# Altium schematic sheet Power.SchDoc
size A4; SheetNumber: 6; SheetTotal: 7
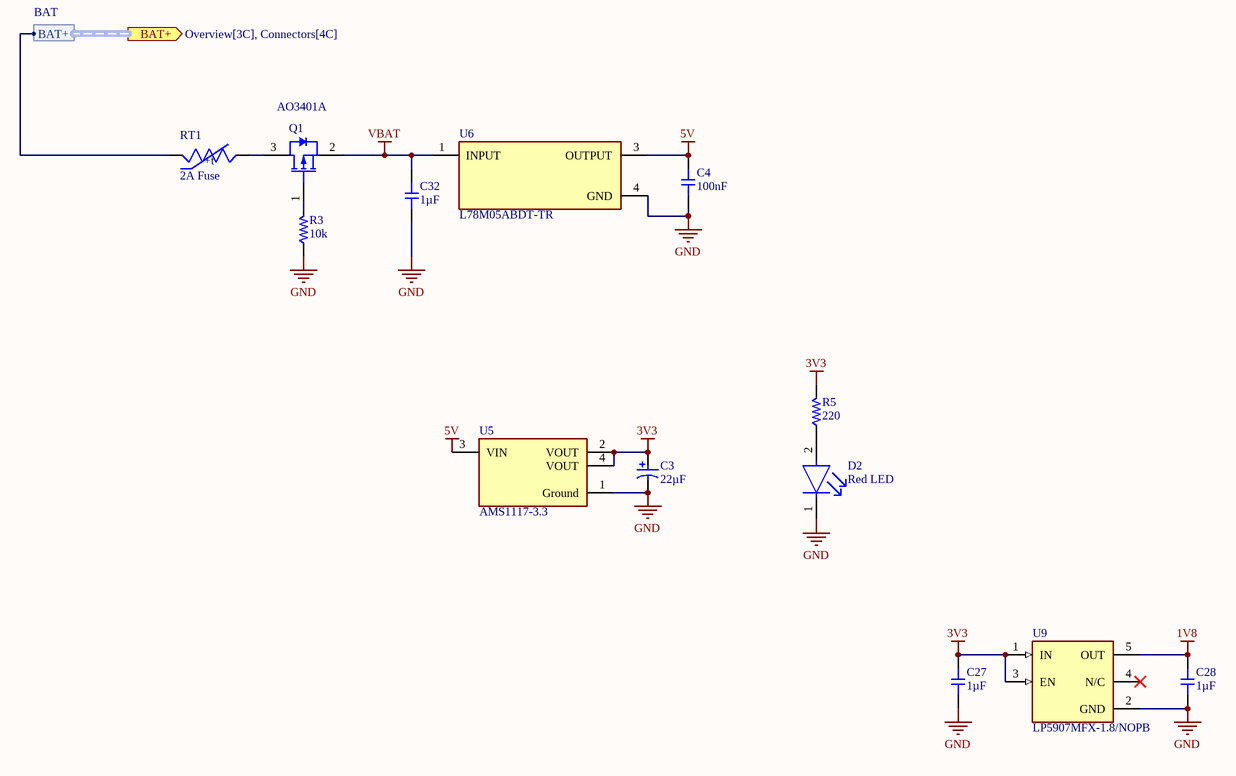
[diagram p0: Power.SchDoc]

## Parts
C3  value 22µF  [KEMT-T491-B_M]  (hidden comment: TR3B226K010C0700)
C4  value 100nF  [CAP-0402]  (hidden comment: CL05B104KO5NNNC)
C27  value 1µF  [CAP-0402]  (hidden comment: CL05A105KA5NQNC)
C28  value 1µF  [CAP-0402]  (hidden comment: CL05A105KA5NQNC)
C32  value 1µF  [CAP-0402]  (hidden comment: CL05A105KA5NQNC)
D2  Red LED  [FP-LTST-C190GKT-MFG]
Q1  AO3401A  [AO-SOT-23-3L_V]
R3  value 10k  [RES-0402]  (hidden comment: 0402WGF1002TCE)
R5  value 220  [RES-0402]  (hidden comment: 0402WGF2200TCE)
RT1  2A Fuse  [THRMC1608X95N]
U5  AMS1117-3.3  [FP-AMS1117-IPC_B]
U6  L78M05ABDT-TR  [FP-L78M05ABDT-TR-MFG]
U9  LP5907MFX-1.8/NOPB  [SOT95P280X145-5N]

## Ports
BAT+ (out, harness BAT, see Overview[3C], Connectors[4C])

## Harnesses
BAT: BAT+

## Nets
1V8: C28.2 U9.5(OUT)
3V3: C3.1 C27.2 R5.2 U5.2(VOUT) U5.4(VOUT) U9.1(IN) U9.3(EN)
5V: C4.2 U5.3(VIN) U6.3(OUTPUT)
GND: C3.2 C4.1 C27.1 C28.1 C32.1 D2.1(C) R3.1 U5.1(Ground) U6.4(GND) U9.2(GND)
VBAT: C32.2 Q1.2(SOURCE) U6.1(INPUT)
NetD2_2: D2.2(A) R5.1
NetQ1_1: Q1.1(GATE) R3.2
NetQ1_3: Q1.3(DRAIN) RT1.2
NetRT1_1: RT1.1 ; port BAT+.BAT+

Not connected (* = marked no-connect by the designer): U9 4(N/C)*

## Notes on the sheet
- (in symbol CMP-038-000000-2) +t

## Library data of the parts
C3 = CMP-001-00179-1: Tantalum Capacitor, Polarized, Tantalum (dry/solid), 10V, 10% +Tol, 10% -Tol, 22uF, Surface Mount, 1411; ESR (Equivalent Series Resistance): 700mR; Ripple Current: 350mA; Min Operating Temperature: -55°C; RoHS Compliant: Yes; Case/Package: 1411; JLCPCB Part Number: C1953127; Max Operating Temperature: 125°C; Dielectric Material: Tantalum; Pins: 2; Mounting Technology: Surface Mount; Voltage Rating: 10V; Capacitor Type: Tantalum
C4 = CMP-001-00142-1: Capacitor, Ceramic (MLCC), 100nF, ±10%, 16V, X7R, ±10%, SMD 0402; Manufacturer: Samsung Electro-Mechanics; Design Item ID: CL05B104KO5NNNC; Source: jlcpcb_capacitors_basic.schlib; ComponentLink2URL: https://jlcpcb.com/partdetail/C1525; Voltage Rating: 16V; Tolerance: 10%; Temperature Coefficient: X7R; ComponentLink2Description: JLCPCB Part URL; ComponentLink1URL: https://datasheet.lcsc.com/lcsc/1810191219_Samsung-Electro-Mechanics-CL05B104KO5NNNC_C1525.pdf; JLCPCB Basic Part: Yes; JLCPCB Part Number: C1525; ComponentLink3URL: https://lcsc.com/product-detail/Multilayer-Ceramic-Capacitors-MLCC---SMD-SMT_Samsung-Electro-Mechanics-Samsung-Electro-Mechanics-CL05B104KO5NNNC_C1525.html; Manufacturer Part Number: CL05B104KO5NNNC; ComponentLink1Description: Datasheet; Case/Package: 0402; RoHS: Yes; Category: Capacitors - MLCC; ComponentLink3Description: LCSC Part URL
C27 C28 C32 = CMP-001-00135-1: Capacitor, Ceramic (MLCC), 1uF, ±10%, 25V, X5R, ±10%, SMD 0402; Manufacturer: Samsung Electro-Mechanics; Voltage Rating: 25V; RoHS: Yes; Temperature Coefficient: X5R; Tolerance: 10%; Source: jlcpcb_capacitors_basic.schlib; ComponentLink1URL: https://datasheet.lcsc.com/lcsc/1811091611_Samsung-Electro-Mechanics-CL05A105KA5NQNC_C52923.pdf; JLCPCB Basic Part: Yes; ComponentLink1Description: Datasheet; ComponentLink2URL: https://jlcpcb.com/partdetail/C52923; Case/Package: 0402; ComponentLink3Description: LCSC Part URL; Manufacturer Part Number: CL05A105KA5NQNC; ComponentLink3URL: https://lcsc.com/product-detail/Multilayer-Ceramic-Capacitors-MLCC---SMD-SMT_Samsung-Electro-Mechanics-Samsung-Electro-Mechanics-CL05A105KA5NQNC_C52923.html; Design Item ID: CL05A105KA5NQNC; JLCPCB Part Number: C52923; ComponentLink2Description: JLCPCB Part URL; Category: Capacitors - MLCC
D2 = CMP-00026-00001-1: SZYY0603R; JLCPCB Part Number: C2286
Q1 = CMP-013-00037-1: P沟道 VDS=-30V VGS=±12V ID=-4A P=1.4W; JLCPCB Part Number: C15127
R3 = CMP-009-00191-1: Resistor, 10kΩ, ±1%, 62.5mW, 50V, ±100ppm/℃, -55℃~+155℃, SMD 0402; Manufacturer: Uniroyal; Temperature Rating: -55℃~+155℃; ComponentLink1URL: https://datasheet.lcsc.com/lcsc/2206010100_UNI-ROYAL-Uniroyal-Elec-0402WGF1002TCE_C25744.pdf; Source: jlcpcb_resistors_basic.schlib; Tolerance: 1%; Design Item ID: 0402WGF1002TCE; ComponentLink1Description: Datasheet; ComponentLink2URL: https://jlcpcb.com/partdetail/C25744; Category: Resistors; JLCPCB Part Number: C25744; ComponentLink2Description: JLCPCB Part URL; Temperature Coefficient: ±100ppm/℃; JLCPCB Basic Part: Yes; Power Rating: 62.5mW; Case/Package: 0402; Voltage Rating: 50V; Manufacturer Part Number: 0402WGF1002TCE
R5 = CMP-009-00210-1: Resistor, 220Ω, ±1%, 62.5mW, 50V, ±100ppm/℃, -55℃~+155℃, SMD 0402; Manufacturer: Uniroyal; Category: Resistors; Case/Package: 0402; Temperature Rating: -55℃~+155℃; Temperature Coefficient: ±100ppm/℃; ComponentLink2URL: https://jlcpcb.com/partdetail/C25091; Tolerance: 1%; JLCPCB Part Number: C25091; Source: jlcpcb_resistors_basic.schlib; Power Rating: 62.5mW; Design Item ID: 0402WGF2200TCE; ComponentLink1URL: https://datasheet.lcsc.com/lcsc/2205311900_UNI-ROYAL-Uniroyal-Elec-0402WGF2200TCE_C25091.pdf; JLCPCB Basic Part: Yes; Manufacturer Part Number: 0402WGF2200TCE; Voltage Rating: 50V; ComponentLink2Description: JLCPCB Part URL; ComponentLink1Description: Datasheet
RT1 = CMP-038-000000-2: PTC Resettable Fuse: 2A Hold, 4A Trip, 0603; Hold Current: 2A; Pin Count: 2; Component Type: Standard; Availability: Unavailable; MP: BSMD0603L-200; Package: 0603; Design Item ID: BSMD0603L-200; Trip Current: 4A; JLCPCB Part Number: C2757930
U5 = CMP-019-00058-2: Fixed Positive LDO Regulator, 3.3V, 1.3V Dropout, PDSO3; Case/Package: SOP; Pins: 3; RoHS Compliant: Yes; JLCPCB Part Number: C6186
U6 = CMP-019-00057-2: Fixed Positive Standard Regulator, 5VBIPolar, PSSO2; Max Supply Voltage: 25V; Pins: 2; RoHS Compliant: Yes; Case/Package: TO-252; JLCPCB Part Number: C58069
U9 = CMP-122-000000-3: 250-mA, low-noise, high-PSRR, low-IQ, ultra-low-dropout voltage regulator with low-IQ and enable 5-SOT-23 -40 to 125; Design Item ID: LP5907MFX-1.8/NOPB; JLCPCB Part Number: C92498; MP: LP5907MFX-1.8/NOPB